# Altium schematic sheet drvcomm.SchDoc: JKA 2.0 原理图
size A4; Author: JACK; CompanyName: 北京康洁之晨水处理技术有限公司; DrawnBy: 郭相炳; Organization: 北京康洁; DocumentNumber: 6; Revision: 2.0; SheetNumber: 6; SheetTotal: 6; ImagePath: E:\JKAdoc\data\LOGO.jpg; ProjectName: JKA2.0
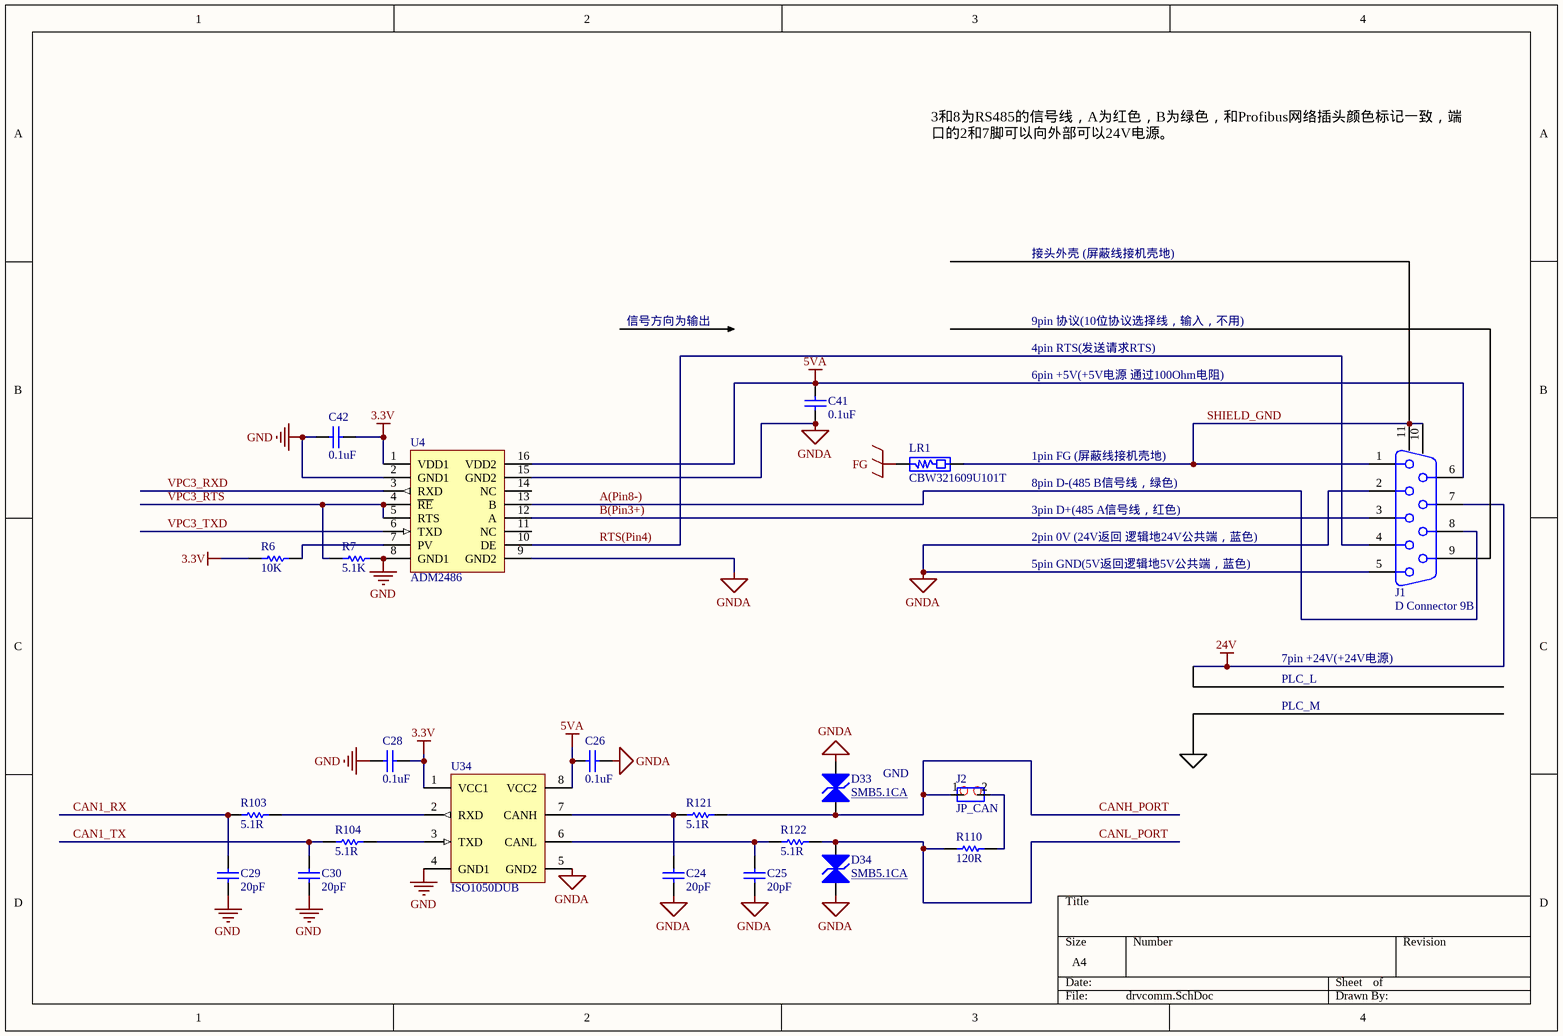
[diagram p0: drvcomm.SchDoc]

## Parts
C24  20pF  [CAPC2012M]
C25  20pF  [CAPC2012M]
C26  0.1uF  [CAPC2012M]
C28  0.1uF  [CAPC2012M]
C29  20pF  [CAPC2012M]
C30  20pF  [CAPC2012M]
C41  0.1uF  [CAPC2012M]
C42  0.1uF  [CAPC2012M]
D33  SMB5.1CA  [SMB]
D34  SMB5.1CA  [SMB]
J1  D Connector 9B  [DSUB1.385-2H9BL]
J2  JP_CAN  [DS-01]
LR1  CBW321609U101T  [INDC3216M]
R6  10K  [RESC2012M]
R7  5.1K  [RESC2012M]
R103  5.1R  [RESC2012M]
R104  5.1R  [RESC2012M]
R110  120R  [RESC2012M]
R121  5.1R  [RESC2012M]
R122  5.1R  [RESC2012M]
U4  ADM2486  [RW-16_N]
U34  ISO1050DUB  [SO-8LA]

## Nets
3.3V: C28.1 C42.1 R6.1 U4.1(VDD1) U34.1(VCC1)
5VA: C26.1 C41.1 J1.6 U4.16(VDD2) U34.8(VCC2)
24V: J1.7
FG: LR1.1
GND: C28.2 C29.1 C30.1 C42.2 R7.1 U4.2(GND1) U4.8(GND1) U34.4(GND1)
GNDA: C24.1 C25.1 C26.2 C41.2 D33.1(A) D34.1(A) J1.2 J1.5 U4.9(GND2) U4.15(GND2) U34.5(GND2)
A(Pin8-): J1.8 U4.13(B)
B(Pin3+): J1.3 U4.12(A)
CAN1_RX: C29.2 R103.2
CAN1_TX: C30.2 R104.2
CANH_PORT: D33.2(K) J2.1 R121.1
CANL_PORT: D34.2(K) R110.2 R122.1
RTS(Pin4): J1.4 U4.10(DE)
SHIELD_GND: J1.1 J1.10(MH1) J1.11(MH2) LR1.2
VPC3_RTS: R7.2 U4.4(~{RE}) U4.5(RTS)
VPC3_RXD: U4.3(RXD)
VPC3_TXD: U4.6(TXD)
NetC24_2: C24.2 R121.2 U34.7(CANH)
NetC25_2: C25.2 R122.2 U34.6(CANL)
NetJ2_2: J2.2 R110.1
NetR6_2: R6.2 U4.7(PV)
NetR103_1: R103.1 U34.2(RXD)
NetR104_1: R104.1 U34.3(TXD)

Not connected (* = marked no-connect by the designer): J1 9; U4 11(NC) 14(NC)

## Notes on the sheet
- 3和8为RS485的信号线，A为红色，B为绿色，和Profibus网络插头颜色标记一致，端口的2和7脚可以向外部可以24V电源。
- 接头外壳 (屏蔽线接机壳地)
- 信号方向为输出
- 9pin 协议(10位协议选择线，输入，不用)
- 4pin RTS(发送请求RTS)
- 6pin +5V(+5V电源 通过100Ohm电阻)
- 3pin D+(485 A信号线，红色)
- 8pin D-(485 B信号线，绿色)
- 1pin FG (屏蔽线接机壳地)
- 2pin 0V (24V返回 逻辑地24V公共端，蓝色)
- 5pin GND(5V返回逻辑地5V公共端，蓝色)
- 7pin +24V(+24V电源)
- PLC_L
- PLC_M
- GND

## Library data of the parts
C24-C26 C28-C30 C41 C42 = Cap: Capacitor; Value: 1nF; Published: 8-Jun-2000; LatestRevisionDate: 17-Jul-2002; LatestRevisionNote: Re-released for DXP Platform.; PackageReference: RAD-0.3; Publisher: Altium Limited
D33 D34 = Bi-dir TVS Diode: Published: 8-Jun-2000; LatestRevisionDate: 17-Jul-2002; LatestRevisionNote: Re-released for DXP Platform.; PackageReference: DIODE-0.7; Publisher: Altium Limited
J1 = D Connector 9B: Receptacle Assembly, 9 Position, Upright; PackageDocument: B; Positions: 15; Gender: Receptacle Header; Published: 15-Jun-2001; LatestRevisionDate: 17-Jul-2002; LatestRevisionNote: Re-released for DXP Platform.; DatasheetDocument: 24-Nov-1999; PackageReference: 788574; Publisher: Altium Limited; Orientation: Right Angle
J2 = JK2H: 'Dial Switch pitch 7.62mm
LR1 = BLM10/11/21/31/41: EMI FILTERS,DC Resistance max.0.05~1.5 ohms,10 ~ 1000 ohms at 100MHz  Frequency
R6 = Res1: Resistor; Published: 8-Jun-2000; LatestRevisionDate: 17-Jul-2002; LatestRevisionNote: Re-released for DXP Platform.; PackageReference: AXIAL-0.3; Publisher: Altium Limited; Value: 10K
R7 R103 R104 R110 R121 R122 = Res1: Resistor; Value: 10K; Published: 8-Jun-2000; LatestRevisionDate: 17-Jul-2002; LatestRevisionNote: Re-released for DXP Platform.; PackageReference: AXIAL-0.3; Publisher: Altium Limited
U4 = ADM2486: Isolated RS-485 Transceiver
U34 = ISO1050DUB: 隔离型CAN接口芯片